# EAGLE schematic Enclosure 100x68 PMJR (EAGLE 9.6.2)
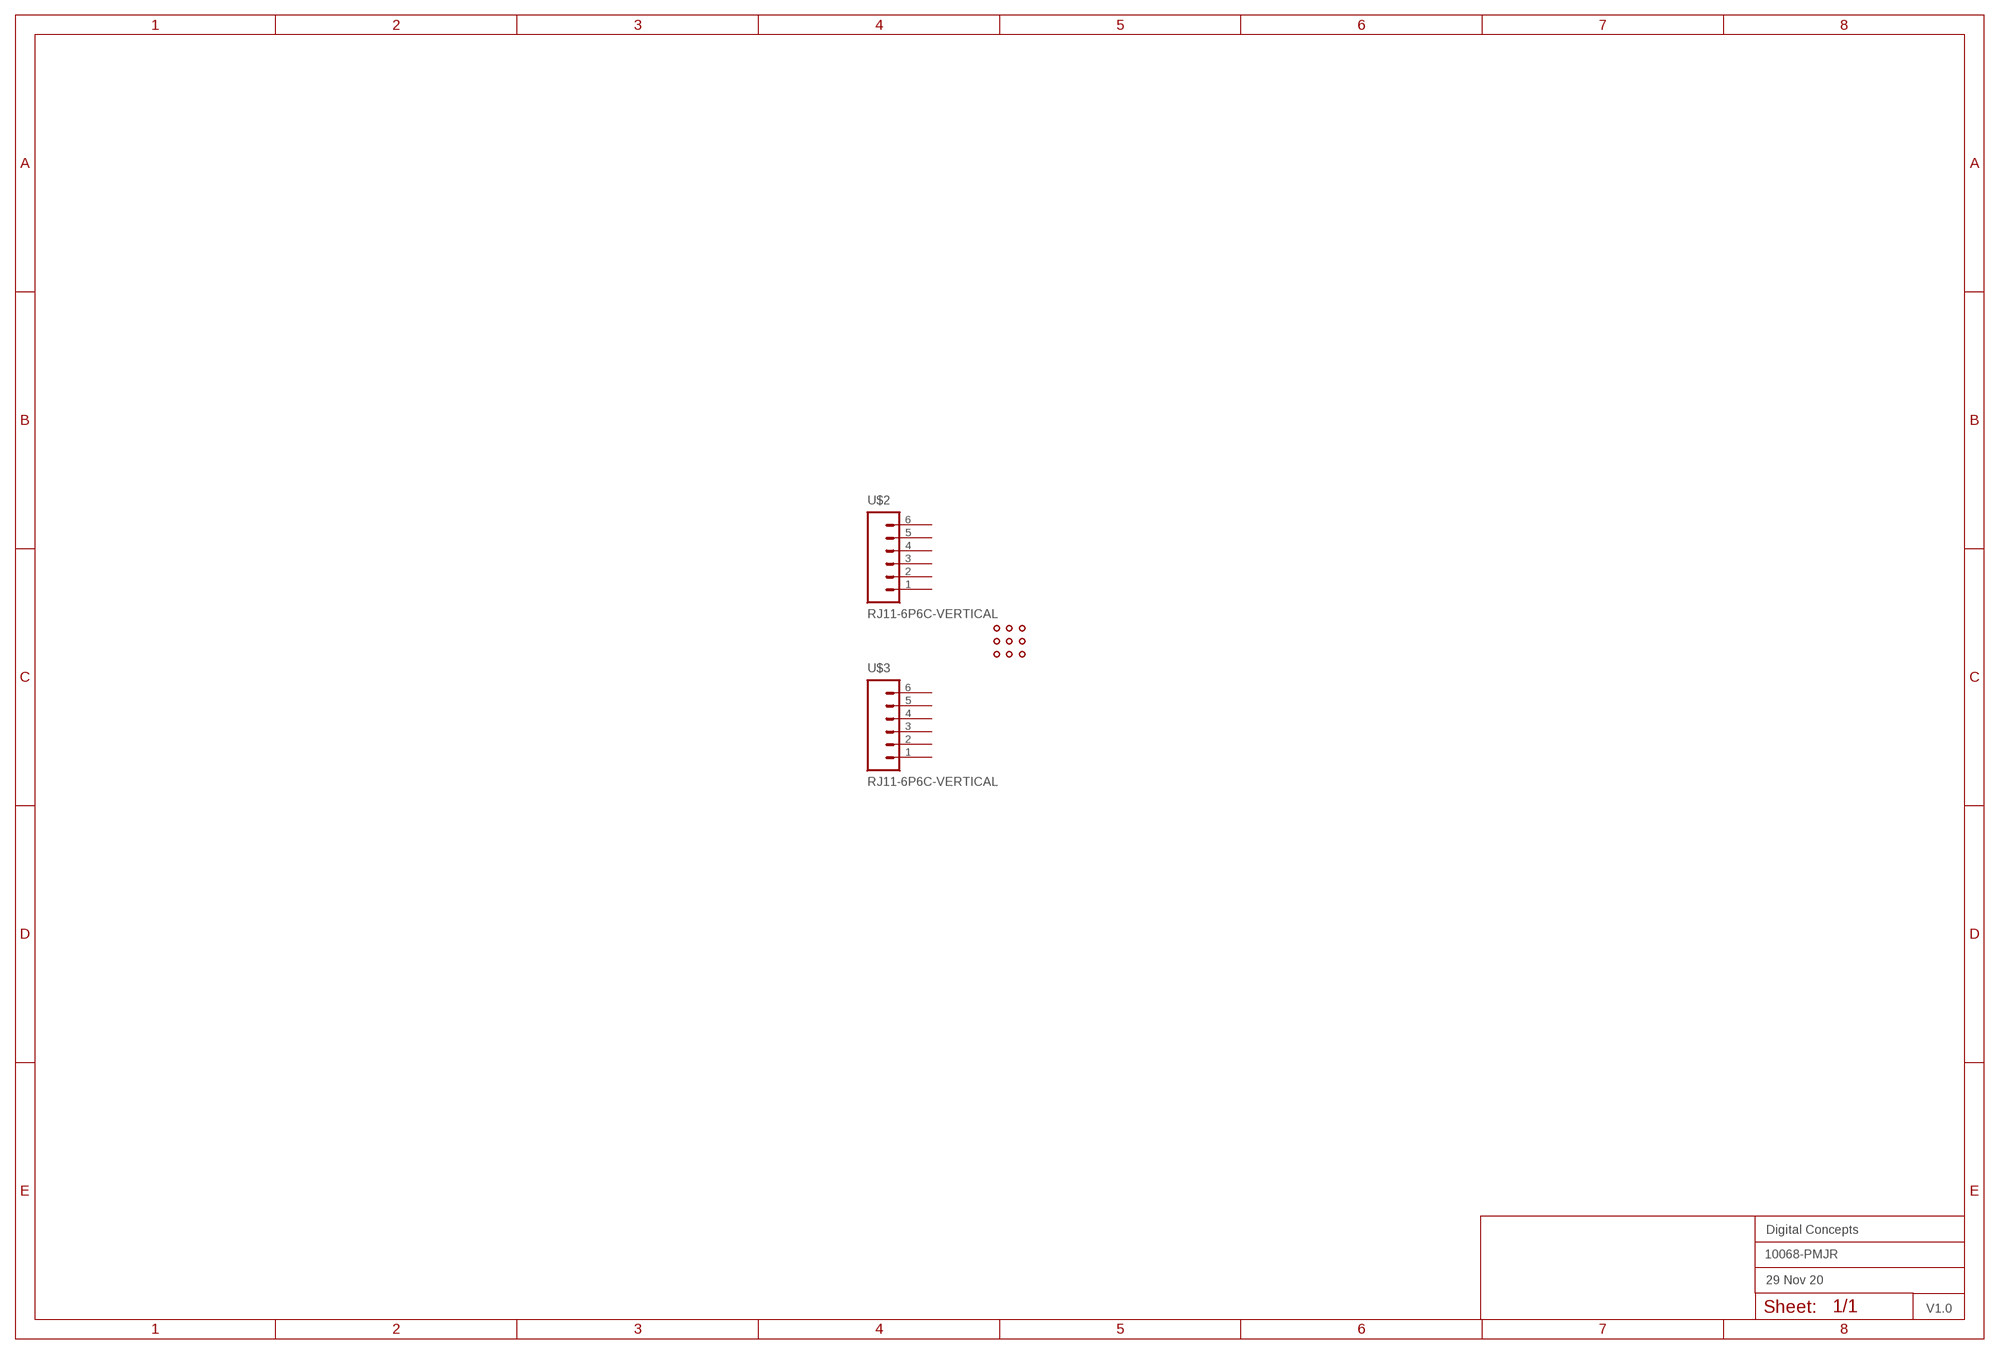
[diagram p0: schematic, sheet 1]
FRAME2 (A3L-LOC): DATE: 29 Nov 20; OWNER: Digital Concepts; TITLE: 10068-PMJR; VERSION: V1.0

## Parts
U$1  PROTO-34X22-JST-RJ  [PROTO-34X22-JST-RJ]
U$2  RJ11-6P6C-VERTICAL  [RJ11-6-VERTICAL]
U$3  RJ11-6P6C-VERTICAL  [RJ11-6-VERTICAL]
Unconnected: U$2.1 U$2.2 U$2.3 U$2.4 U$2.5 U$2.6 U$3.1 U$3.2 U$3.3 U$3.4 U$3.5 U$3.6

## Library data of the parts
U$1 = digitalconcepts:PROTO-34X22-JST-RJ: 34 x 22 Prototyping board with JST connector points and space for RJ11 sockets to fit an 100 x 68 enclosure
U$2 U$3 = digitalconcepts:RJ11-6P6C-VERTICAL: RJ11-6P6C-Vertical PCB Socket